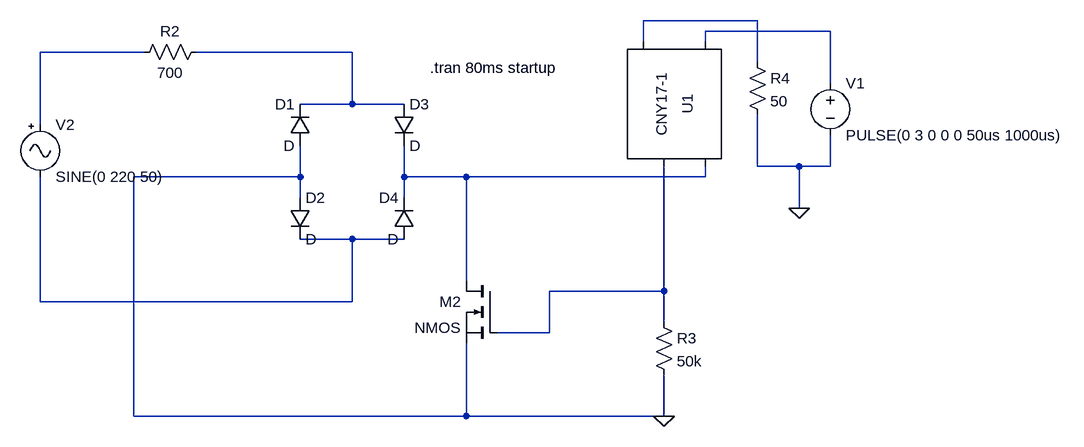
[diagram p0: schematic mosfet_ac_switch.asc]
mosfet_ac_switch.asc, the LTspice schematic file:
Version 4
SHEET 1 1608 728
WIRE 1056 80 880 80
WIRE 1168 96 976 96
WIRE 880 112 880 80
WIRE 976 112 976 96
WIRE 112 128 -48 128
WIRE 432 128 192 128
WIRE 1056 144 1056 80
WIRE 1168 176 1168 96
WIRE 432 208 432 128
WIRE 432 208 352 208
WIRE 512 208 432 208
WIRE -48 240 -48 128
WIRE 1056 304 1056 224
WIRE 1120 304 1056 304
WIRE 1168 304 1168 256
WIRE 1168 304 1120 304
WIRE 352 320 352 272
WIRE 352 320 96 320
WIRE 512 320 512 272
WIRE 608 320 512 320
WIRE 976 320 976 304
WIRE 976 320 608 320
WIRE 352 352 352 320
WIRE 512 352 512 320
WIRE 1120 368 1120 304
WIRE 432 416 352 416
WIRE 512 416 432 416
WIRE 608 480 608 320
WIRE 912 496 912 304
WIRE 912 496 736 496
WIRE -48 512 -48 320
WIRE 432 512 432 416
WIRE 432 512 -48 512
WIRE 912 544 912 496
WIRE 736 560 736 496
WIRE 736 560 656 560
WIRE 96 688 96 320
WIRE 608 688 608 576
WIRE 608 688 96 688
WIRE 912 688 912 624
WIRE 912 688 608 688
FLAG 1120 368 0
FLAG 912 688 0
SYMBOL Misc/signal -48 224 R0
SYMATTR InstName V2
SYMATTR Value SINE(0 220 50)
SYMBOL res 208 112 R90
WINDOW 0 0 56 VBottom 2
WINDOW 3 32 56 VTop 2
SYMATTR InstName R2
SYMATTR Value 700
SYMBOL diode 368 272 R180
WINDOW 0 24 64 Left 2
WINDOW 3 24 0 Left 2
SYMATTR InstName D1
SYMBOL diode 336 352 R0
SYMATTR InstName D2
SYMBOL diode 496 208 R0
SYMATTR InstName D3
SYMBOL diode 528 416 R180
WINDOW 0 24 64 Left 2
WINDOW 3 24 0 Left 2
SYMATTR InstName D4
SYMBOL voltage 1168 160 R0
SYMATTR InstName V1
SYMATTR Value PULSE(0 3 0 0 0 50us 1000us)
SYMBOL Optos/CNY17-1 912 208 R90
SYMATTR InstName U1
SYMBOL res 896 528 R0
SYMATTR InstName R3
SYMATTR Value 50k
SYMBOL res 1040 128 R0
SYMATTR InstName R4
SYMATTR Value 50
SYMBOL nmos 656 480 M0
SYMATTR InstName M2
TEXT 552 152 Left 2 !.tran 80ms startup

The netlist it stands for:
* mosfet_ac_switch.asc
V2 N003 N006 SINE(0 220 50)
R2 N004 N003 700
D1 0 N004 D
D2 0 N006 D
D3 N004 N005 D
D4 N006 N005 D
V1 N002 0 PULSE(0 3 0 0 0 50us 1000us)
XU1 N002 N001 N005 N007 NC_01 CNY17 Igain=.724m
R3 N007 0 50k
R4 N001 0 50
M2 N005 N007 0 0 NMOS
.model D D
.lib standard.dio
.model NMOS NMOS
.model PMOS PMOS
.lib standard.mos
.tran 80ms startup
.lib CNY17.sub
.backanno
.end